# Altium schematic sheet [05] RTC_RS232_USB.SchDoc
size A4
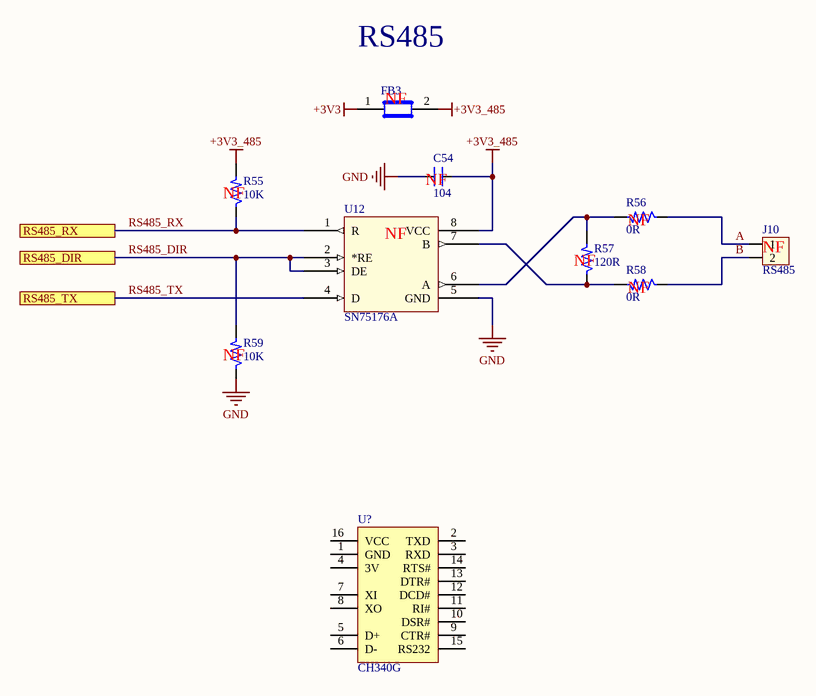
[diagram p0: [05] RTC_RS232_USB.SchDoc]

## Parts
C54  104  [CAP_0805]
FB3  BLM21PG600SN1D  [R0805]  (value not drawn)
J10  RS485  [Hed2V_3.96]
R55  10K  [RES-SMD-0805]
R56  0R  [RES-SMD-0805]
R57  120R  [RES-SMD-0805]
R58  0R  [RES-SMD-0805]
R59  10K  [RES-SMD-0805]
U12  SN75176A  [SN75176A]
U?  CH340G  [SO16]

## Ports
RS485_DIR, RS485_RX, RS485_TX

## Nets
+3V3: FB3.1
+3V3_485: C54.2 FB3.2 R55.2 U12.8(VCC)
GND: C54.1 R59.1 U12.5(GND)
A: J10.1 R56.1
B: J10.2 R58.1
RS485_DIR: R59.2 U12.2(*RE) U12.3(DE) ; port RS485_DIR
RS485_RX: R55.1 U12.1(R) ; port RS485_RX
RS485_TX: U12.4(D) ; port RS485_TX
NetR56_2: R56.2 R57.2 U12.6(A)
NetR57_1: R57.1 R58.2 U12.7(B)

Not connected (* = marked no-connect by the designer): U? 1(GND) 2(TXD) 3(RXD) 4(3V) 5(D+) 6(D-) 7(XI) 8(XO) 9(CTR#) 10(DSR#) 11(RI#) 12(DCD#) 13(DTR#) 14(RTS#) 15(RS232) 16(VCC)

## Notes on the sheet
- RS485
- (near FB3) NF
- (near R55) NF
- (near C54) NF
- (near U12) NF
- (near R57) NF
- (near R56) NF
- (near J10) NF
- (near R58) NF
- (near R59) NF

## Library data of the parts
C54 = CM: Cap SMD; Value: 103
FB3 = Ferrite Bead
J10 = Hed2: Header 2 (Green); Value: Header 2
R55-R59 = RM: Resistor SMD; Value: 1K
U? = CH340G: High and Low Side Driver; Note: Pins 4, 8 and 14 are not connected; Published: 8-Jun-2000; LatestRevisionDate: 04-Mar-2005; LatestRevisionNote: Stylized 3D Model Added.; DatasheetVersion: PD60147J; PackageReference: PDIP14; Publisher: Altium Limited; PackageDescription: DIP; 14 Leads; Row Spacing 7.62 mm; Pitch 2.54 mm; ComponentLink1Description: Manufacturer Link; ComponentLink1URL: http://www.irf.com/; ComponentLink2Description: Datasheet; ComponentLink2URL: http://www.irf.com/product-info/datasheets/data/ir2110.pdf